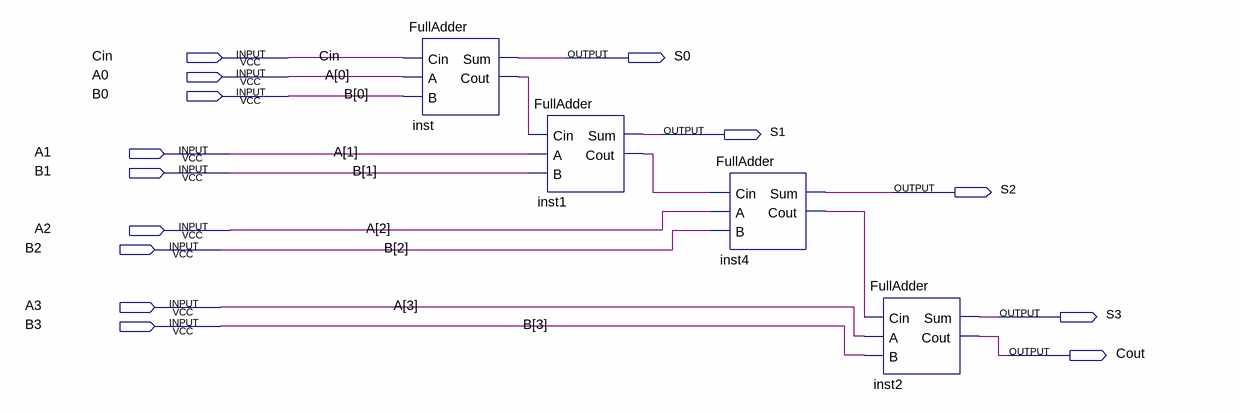
[diagram p0: schematic sheet]
// Quartus schematic 4BitAdder.bdf as structural Verilog: 4 symbols, 14 pins
module \4BitAdder  (
  input  Cin,
  input  A0,
  input  B0,
  input  A1,
  input  B1,
  input  A2,
  input  B2,
  input  A3,
  input  B3,
  output S0,
  output S1,
  output S2,
  output S3,
  output Cout
);

  wire inst1_cout, inst4_cout, inst_cout;

  FullAdder inst (.Cin(Cin), .A(A0), .B(B0), .Sum(S0), .Cout(inst_cout));
  FullAdder inst1 (.Cin(inst_cout), .A(A1), .B(B1), .Sum(S1), .Cout(inst1_cout));
  FullAdder inst4 (.Cin(inst1_cout), .A(A2), .B(B2), .Sum(S2), .Cout(inst4_cout));
  FullAdder inst2 (.Cin(inst4_cout), .A(A3), .B(B3), .Sum(S3), .Cout(Cout));
endmodule
